# Altium schematic sheet DCI_USB.SchDoc
size 420 x 297 mm; ENG_APP_DATE: --/--/--; DSN_APP_DATE: --/--/--; CHK_APP_DATE: --/--/--
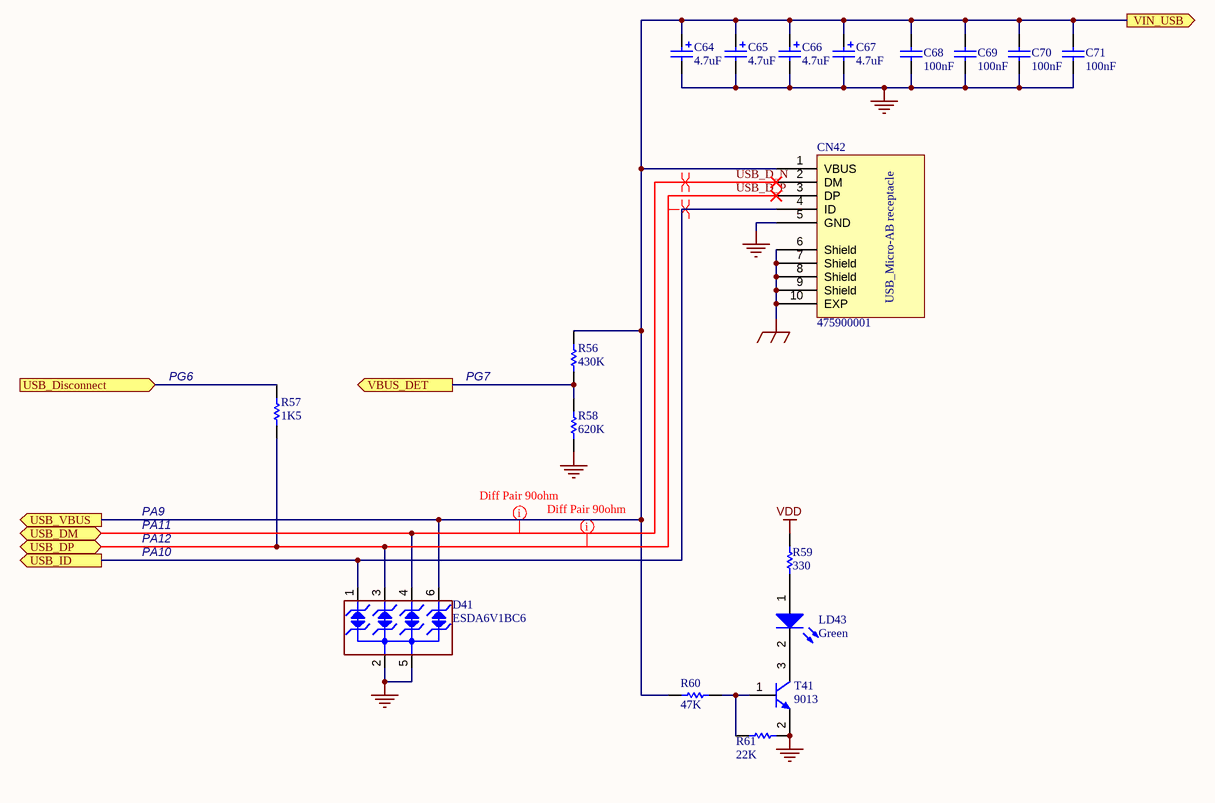
[diagram p0: DCI_USB.SchDoc]

## Parts
C64  4.7uF  [TAN-A - XNo]
C65  4.7uF  [TAN-A - XUp]
C66  4.7uF  [TAN-A - XNo]
C67  4.7uF  [TAN-A - XDown]
C68  100nF  [0603C]
C69  100nF  [0603C]
C70  100nF  [0603C]
C71  100nF  [0603C]
CN42  475900001  [MOLEX_47590001]
D41  ESDA6V1BC6  [SOT23-6L]
LD43  Green  [0603D-G]
R56  430K  [0603R]
R57  1K5  [0603R]
R58  620K  [0603R]
R59  330  [0603R]
R60  47K  [0603R]
R61  22K  [0603R]
T41  9013  [SOT-23]

## Ports
USB_Disconnect (in), USB_DM (bidir), USB_DP (bidir), USB_ID (out), USB_VBUS (out), VBUS_DET (out), VIN_USB (out)

## Nets
EGND: CN42.6(Shield) CN42.7(Shield) CN42.8(Shield) CN42.9(Shield) CN42.10(EXP)
GND: C64.2 C65.2 C66.2 C67.2 C68.2 C69.2 C70.2 C71.2 CN42.5(GND) D41.2(IO2) D41.5(IO4) R58.2 R61.1 T41.2(E)
VDD: R59.2
USB_D_N: CN42.2(DM) D41.4(IO3) ; port USB_DM
USB_D_P: CN42.3(DP) D41.3(GND) R57.1 ; port USB_DP
USB_Disconnect: R57.2 ; port USB_Disconnect
USB_ID: CN42.4(ID) D41.1(IO1) ; port USB_ID
USB_VBUS: C64.1 C65.1 C66.1 C67.1 C68.1 C69.1 C70.1 C71.1 CN42.1(VBUS) D41.6(NC) R56.1 R60.1 ; port USB_VBUS, port VIN_USB
VBUS_DET: R56.2 R58.1 ; port VBUS_DET
NetLD43_1: LD43.1(A) R59.1
NetLD43_2: LD43.2(K) T41.3(C)
NetR60_2: R60.2 R61.2 T41.1(B)

## Layout directives
mark named Diff Pair 90ohm: USB_D_N, USB_D_P
differential pair: USB_D_N, USB_D_P

## Notes on the sheet
- PG6
- PG7
- PA10
- PA9
- PA12
- PA11
- MEMBERS:
- Universitat Politècnica de València
- - Gianmarco Leopoldo Sangoi
- - Vicente Beltrán Morte
- PROJECT:
- SIZE:
- FILE NAME:
- A3
- NUMBER:
- 3
- REVISION:
- A1
- DATE:
- 07/05/2022
- SHEET
- OF
- 7
- (in symbol 475900001) USB_Micro-AB receptacle

## Library data of the parts
C64-C67 = Cap Pol1: Polarized Capacitor (Radial); Value: 47uF; Published: 8-Jun-2000; Revision: July-2002: Re-released for DXP Platform.; Publisher: Altium Limited
C68-C71 = Cap: Capacitor; Value: 10nF; Published: 8-Jun-2000; Revision: July-2002: Re-released for DXP Platform.; Publisher: Altium Limited
D41 = ESDA6V1BC6: 4-line ESD protection; Manuf_1: STM; Manuf_Part_1: ESDA5V3L; Ref St: 9179034; Provided: ST; ECCN_US/EU: EAR99/NEC; Distrib: ST; Order: ESDA5V3L; Ordered by: STM
LD43 = LED2: Typical RED, GREEN, YELLOW, AMBER GaAs LED; Published: 8-Jun-2000; Revision: July-2002: Re-released for DXP Platform.; Publisher: Altium Limited
R56 R58-R61 = res1: Resistor; Value: 1K; Published: 8-Jun-2000; Revision: July-2002: Re-released for DXP Platform.; Publisher: Altium Limited
R57 = Resistor_ST: Resistor 0402 / 0603 / 0805; Value: 10K
T41 = NPN: NPN Bipolar Transistor; Code - JEDEC: TO-226-AA; Published: 8-Jun-2000; Revision: July-2002: Re-released for DXP Platform.; Publisher: Altium Limited